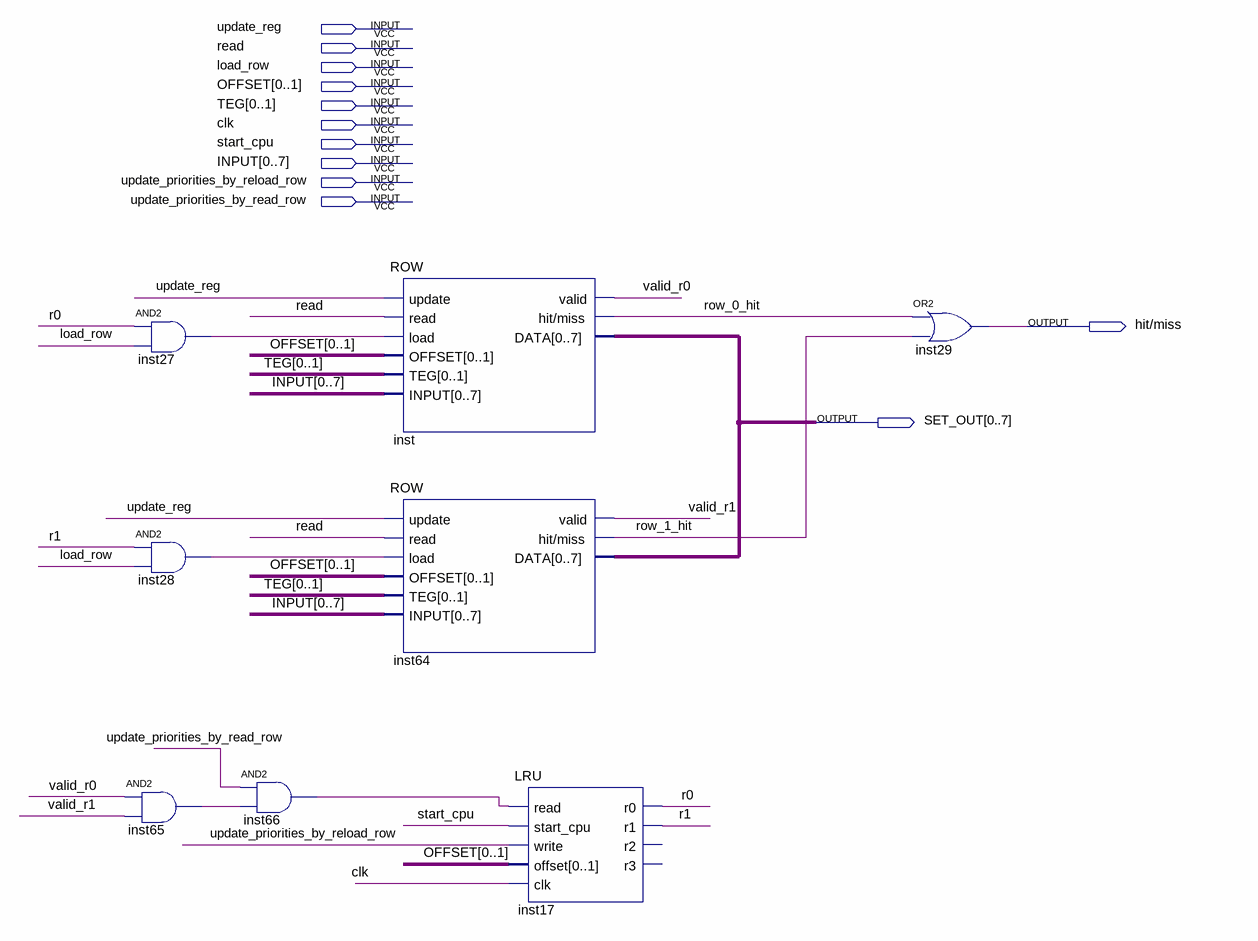
[diagram p0: schematic sheet]
// Quartus schematic SET.bdf as structural Verilog: 8 symbols, 12 pins
module SET (
  input  update_reg,
  input  read,
  input  load_row,
  input  [0:1] OFFSET,
  input  [0:1] TEG,
  input  clk,
  input  start_cpu,
  input  [0:7] INPUT,
  input  update_priorities_by_reload_row,
  input  update_priorities_by_read_row,
  output \hit/miss ,
  output [0:7] SET_OUT
);

  wire inst27_out, inst28_out, inst65_out, inst66_out, r0, r1, row_0_hit, row_1_hit, valid_r0, valid_r1;

  and inst27 (inst27_out, r0, load_row);
  and inst28 (inst28_out, r1, load_row);
  and inst65 (inst65_out, valid_r0, valid_r1);
  and inst66 (inst66_out, update_priorities_by_read_row, inst65_out);
  ROW inst (
    .update(update_reg), .read(read), .load(inst27_out), .OFFSET(OFFSET), .TEG(TEG), .INPUT(INPUT),
    .valid(valid_r0), .\hit/miss (row_0_hit), .DATA(SET_OUT));
  ROW inst64 (
    .update(update_reg), .read(read), .load(inst28_out), .OFFSET(OFFSET), .TEG(TEG), .INPUT(INPUT),
    .valid(valid_r1), .\hit/miss (row_1_hit), .DATA(SET_OUT));
  LRU inst17 (
    .read(inst66_out), .start_cpu(start_cpu), .write(update_priorities_by_reload_row), .offset(OFFSET),
    .clk(clk), .r0(r0), .r1(r1));  // open: r2, r3
  or inst29 (\hit/miss , row_0_hit, row_1_hit);
endmodule
